# Altium schematic sheet stm32c8t6.SchDoc
size A4
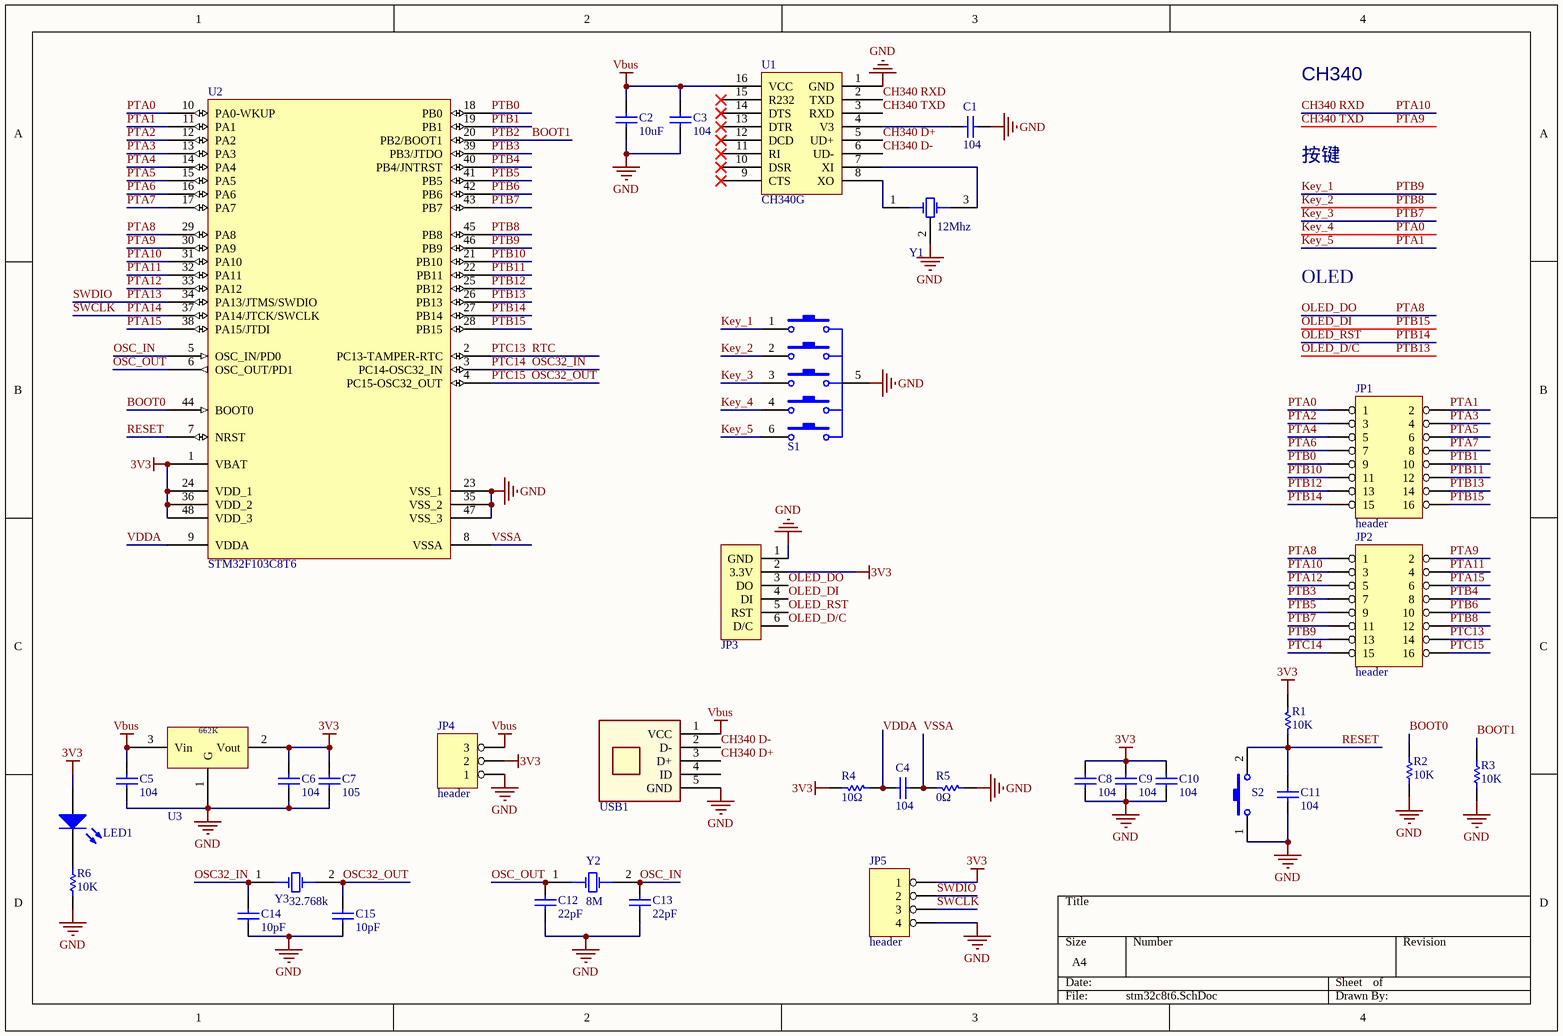
[diagram p0: stm32c8t6.SchDoc]

## Parts
C1  104  [0603_C]
C2  10uF  [0805_c]
C3  104  [0603_C]
C4  104  [0603_C]
C5  104  [0603_C]
C6  104  [0603_C]
C7  105  [0805_c]
C8  104  [0603_C]
C9  104  [0603_C]
C10  104  [0603_C]
C11  104  [0603_C]
C12  22pF  [0603_C]
C13  22pF  [0603_C]
C14  10pF  [0603_C]
C15  10pF  [0603_C]
JP1  header  [header2X8]
JP2  header  [header2X8]
JP3  OLED 6Pin  [OLED_6Pin]  (value not drawn)
JP4  header  [header3]
JP5  header  [header4]
LED1  LED Chip  [CLED1608-0603]  (value not drawn)
R1  10K  [0603_R]
R2  10K  [0603_R]
R3  10K  [0603_R]
R4  10Ω  [0603_R]
R5  0Ω  [0603_R]
R6  10K  [0603_R]
S1  5 way switch  [5 way switch]  (value not drawn)
S2  Key  [SWITCH 4*4]  (value not drawn)
U1  CH340G  [SOIC-16]
U2  STM32F103C8T6  [LQFP48]
U3  XC6206P332MR  [SOT95P280X120-3N]  (value not drawn)
USB1  USB_Mini  [USB_Mini2]  (value not drawn)
Y1  XTAL 8Mhz 3215 3pin  [3213 3Pin]  (value not drawn)
Y2  8M  [5032 2Pin]
Y3  XTAL 32.768KHz 2P  [3215 2Pin]  (value not drawn)

## Nets
3V3: C6.2 C7.2 C8.2 C9.2 C10.2 JP3.2(3.3V) JP4.2 JP5.1 LED1.1(A) R1.1 R4.1 U2.1(VBAT) U2.24(VDD_1) U2.36(VDD_2) U2.48(VDD_3) U3.2(Vout)
GND: C1.1 C2.1 C3.2 C5.1 C6.1 C7.1 C8.1 C9.1 C10.1 C11.1 C12.1 C13.1 C14.1 C15.1 JP3.1(GND) JP4.1 JP5.4 R2.1 R3.1 R5.2 R6.1 S1.5 S2.1 U1.1(GND) U2.23(VSS_1) U2.35(VSS_2) U2.47(VSS_3) U3.1(G) USB1.5(GND) Y1.2(OSC2)
Vbus: C2.2 C3.1 C5.2 JP4.3 U1.16(VCC) U3.3(Vin) USB1.1(VCC)
BOOT0: R2.2 U2.44(BOOT0)
BOOT1: R3.2 U2.20(PB2/BOOT1)  [also labelled PTB2]
CH340 D+: U1.5(UD+) USB1.3(D+)
CH340 D-: U1.6(UD-) USB1.2(D-)
CH340 RXD: JP2.3 U1.2(TXD) U2.31(PA10)  [also labelled PTA10]
CH340 TXD: JP2.2 U1.3(RXD) U2.30(PA9)  [also labelled PTA9]
Key_1: JP2.13 S1.1 U2.46(PB9)  [also labelled PTB9]
Key_2: JP2.12 S1.2 U2.45(PB8)  [also labelled PTB8]
Key_3: JP2.11 S1.3 U2.43(PB7)  [also labelled PTB7]
Key_4: JP1.1 S1.4 U2.10(PA0-WKUP)  [also labelled PTA0]
Key_5: JP1.2 S1.6 U2.11(PA1)  [also labelled PTA1]
OLED_D/C: JP1.14 JP3.6(D/C) U2.26(PB13)  [also labelled PTB13]
OLED_DI: JP1.16 JP3.4(DI) U2.28(PB15)  [also labelled PTB15]
OLED_DO: JP2.1 JP3.3(DO) U2.29(PA8)  [also labelled PTA8]
OLED_RST: JP1.15 JP3.5(RST) U2.27(PB14)  [also labelled PTB14]
OSC32_IN: C14.2 JP2.15 U2.3(PC14-OSC32_IN) Y3.1(OSC1)  [also labelled PTC14]
OSC32_OUT: C15.2 JP2.16 U2.4(PC15-OSC32_OUT) Y3.2(OSC2)  [also labelled PTC15]
OSC_IN: C13.2 U2.5(OSC_IN/PD0) Y2.2(OSC2)
OSC_OUT: C12.2 U2.6(OSC_OUT/PD1) Y2.1(OSC1)
PTA2: JP1.3 U2.12(PA2)
PTA3: JP1.4 U2.13(PA3)
PTA4: JP1.5 U2.14(PA4)
PTA5: JP1.6 U2.15(PA5)
PTA6: JP1.7 U2.16(PA6)
PTA7: JP1.8 U2.17(PA7)
PTA11: JP2.4 U2.32(PA11)
PTA12: JP2.5 U2.33(PA12)
PTA13: JP5.2 U2.34(PA13/JTMS/SWDIO)  [also labelled SWDIO]
PTA14: JP5.3 U2.37(PA14/JTCK/SWCLK)  [also labelled SWCLK]
PTA15: JP2.6 U2.38(PA15/JTDI)
PTB0: JP1.9 U2.18(PB0)
PTB1: JP1.10 U2.19(PB1)
PTB3: JP2.7 U2.39(PB3/JTDO)
PTB4: JP2.8 U2.40(PB4/JNTRST)
PTB5: JP2.9 U2.41(PB5)
PTB6: JP2.10 U2.42(PB6)
PTB10: JP1.11 U2.21(PB10)
PTB11: JP1.12 U2.22(PB11)
PTB12: JP1.13 U2.25(PB12)
PTC13: JP2.14 U2.2(PC13-TAMPER-RTC)  [also labelled RTC]
RESET: C11.2 R1.2 S2.2 U2.7(NRST)
VDDA: C4.2 R4.2 U2.9(VDDA)
VSSA: C4.1 R5.1 U2.8(VSSA)
NetC1_2: C1.2 U1.4(V3)
NetLED1_2: LED1.2(K) R6.2
NetU1_7: U1.7(XI) Y1.3(OSC1)
NetU1_8: U1.8(XO) Y1.1(OSC1)

Not connected (* = marked no-connect by the designer): U1 9(CTS)* 10(DSR)* 11(RI)* 12(DCD)* 13(DTR)* 14(DTS)* 15(R232)*; USB1 4(ID)

## Notes on the sheet
- CH340
- 按键
- OLED
- (in symbol XC6206P332MR) 662K
- (in symbol XTAL 8Mhz 3215 3pin) 12Mhz
- (in symbol XTAL 32.768KHz 2P) 32.768k

## Library data of the parts
C1 C3-C6 C8-C11 = CAP: Capacitor; Published: 8-Jun-2000; LatestRevisionDate: 17-Jul-2002; LatestRevisionNote: Re-released for DXP Platform.; PackageReference: RAD-0.3; Publisher: Altium Limited; Value: 104
C2 C7 C12-C15 = CAP: Capacitor; Value: 104; Published: 8-Jun-2000; LatestRevisionDate: 17-Jul-2002; LatestRevisionNote: Re-released for DXP Platform.; PackageReference: RAD-0.3; Publisher: Altium Limited
JP1 JP2 = HEADER 8X2
JP4 = HEADER 3
JP5 = HEADER 4
LED1 = LED Chip: Typical Chip LED; Published: 8-Jun-2000; Revision: July-2002: Re-released for DXP Platform.; Publisher: Altium Limited
R1-R6 = RES: Resistor; Value: 1K; Published: 8-Jun-2000; Revision: July-2002: Re-released for DXP Platform.; Publisher: Altium Limited
U1 = CH340G: SOIC
U2 = STM32F103C8T6: STM32 ARM-based 32-bit MCU with 64 Kbytes Flash, 48-pin LQFP, Industrial Temperature; Published: 30-May-2008; DatasheetVersion: rev6, Mar-2008; PackageVersion: Mar-2008; PackageReference: LQFP48; Publisher: Altium Limited; PackageDescription: 48-Pin Low-Profile Quad Flat Pack, 7 x 7 mm Body, 0.5 mm Pitch (LQFP48); ComponentLink1Description: Manufacturer Link; ComponentLink1URL: www.st.com/stm32; ComponentLink2Description: Datasheet; ComponentLink2URL: http://www.st.com/stonline/products/literature/ds/13587.pdf
Y2 = XTAL 8Mhz 2pin
U3 = XC6206P332MR: HelpURL: E:\Altium\Help\pdf\OP07X.pdf